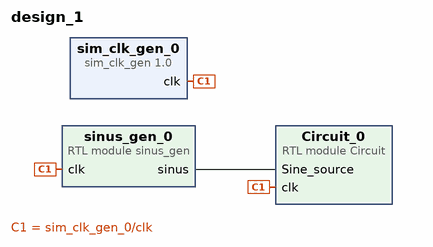
[diagram p0: block diagram of the top level]
# Vivado block design design_1, xc7vx485tffg1157-1, Vivado 2018.3
create_bd_design design_1

create_bd_cell -type ip -vlnv xilinx.com:ip:sim_clk_gen:1.0 sim_clk_gen_0
create_bd_cell -type module -reference sinus_gen sinus_gen_0
create_bd_cell -type module -reference Circuit Circuit_0

# ---- connections ----

connect_bd_net [get_bd_pins sim_clk_gen_0/clk] [get_bd_pins sinus_gen_0/clk] [get_bd_pins Circuit_0/clk]
connect_bd_net [get_bd_pins sinus_gen_0/sinus] [get_bd_pins Circuit_0/Sine_source]

validate_bd_design
save_bd_design
